# EAGLE design pierce-test-board3 (EAGLE 6.4)
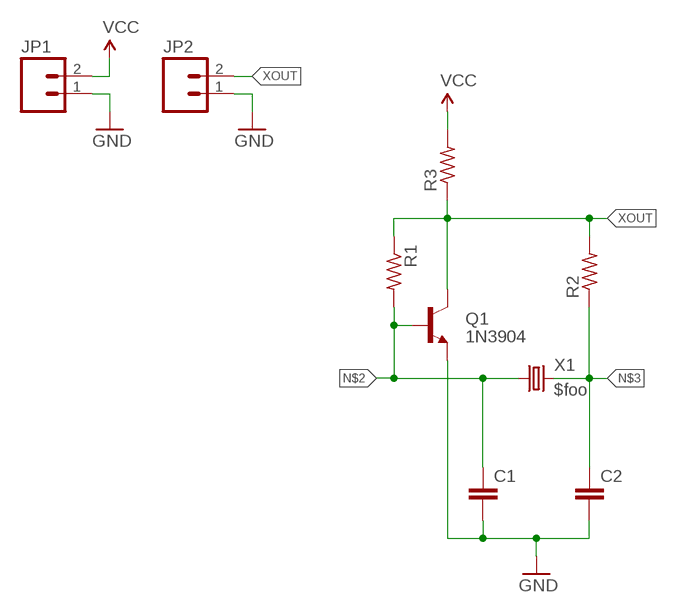
[diagram p0: schematic, sheet 1]

## Parts
C1  CAPACITOR-CERAMIC025-024X044  [C025-024X044]
C2  CAPACITOR-CERAMIC025-024X044  [C025-024X044]
JP1  M02PTH  [1X02]
JP2  M02PTH  [1X02]
Q1  1N3904  TRANSISTOR_NPNTO-92-AMMO-EBC  [TO-92-AMMO]
R1  RESISTORPTH-AXIAL-5.08MM  [RESISTOR-AXIAL-PTH-5.08MM]
R2  RESISTORPTH-AXIAL-5.08MM  [RESISTOR-AXIAL-PTH-5.08MM]
R3  RESISTORPTH-AXIAL-5.08MM  [RESISTOR-AXIAL-PTH-5.08MM]
X1  $foo  CRYSTALHC49UV  [HC49U-V]

## Nets
GND: C1.2 C2.2 JP1.1 JP2.1 Q1.1(E)
N$2: C1.1 Q1.2(B) R1.P$2 X1.1
N$3: C2.1 R2.P$1 X1.2
VCC: JP1.2 R3.P$2
XOUT: JP2.2 Q1.3(C) R1.P$1 R2.P$2 R3.P$1

## Library data of the parts
C1 C2 = A_butts:CAPACITOR-CERAMIC: CAPACITOR, European symbol
JP1 JP2 = A_butts:M02: Standard 2-pin 0.1" header. Use with - straight break away headers ( PRT-00116) - right angle break away headers (PRT-00553) - swiss pins (PRT-00743) - machine pins (PRT-00117) - female headers (PRT-00115) Molex polarized connector foot print use with: PRT-08233 with associated crimp pins and housings. 2.54_SCREWTERM for use with PRT-10571. 3.5mm Screw Terminal footprints for PRT-08084 5mm Screw Terminal footprints for use with PRT-08433
Q1 = A_butts:TRANSISTOR_NPN: Generic NPN BJT MMBT2222A - TRANS-08049 (SOT-23, 1A 40V) MPSA42 - TRANS-09116 (SOT-23, 500mA 300V) MMBT5088LT1G - TRANS-11160 (SOT-23, 50 mA 30V) BC547 - COM-08928 <http://www.sparkfun.com/products/8928> (TO-92 45V 100mA) (1.Collector 2.Base 3.Emitter) 2N3904 - COM-00521 <http://www.sparkfun.com/products/521> (TO-92 40V 200mA) (1.Emitter 2.Base 3.Collector) P2N2222A - COM-12852 <http://www.sparkfun.com/products/12852> (TO-92 40V 600mA) (1.Collector 2.Base 3.Emitter)
R1-R3 = A_butts:RESISTOR: RESISTOR, American symbol
X1 = A_butts:CRYSTAL: Various standard crystals. Proven footprints. Spark Fun Electronics SKU : COM-00534

## Board
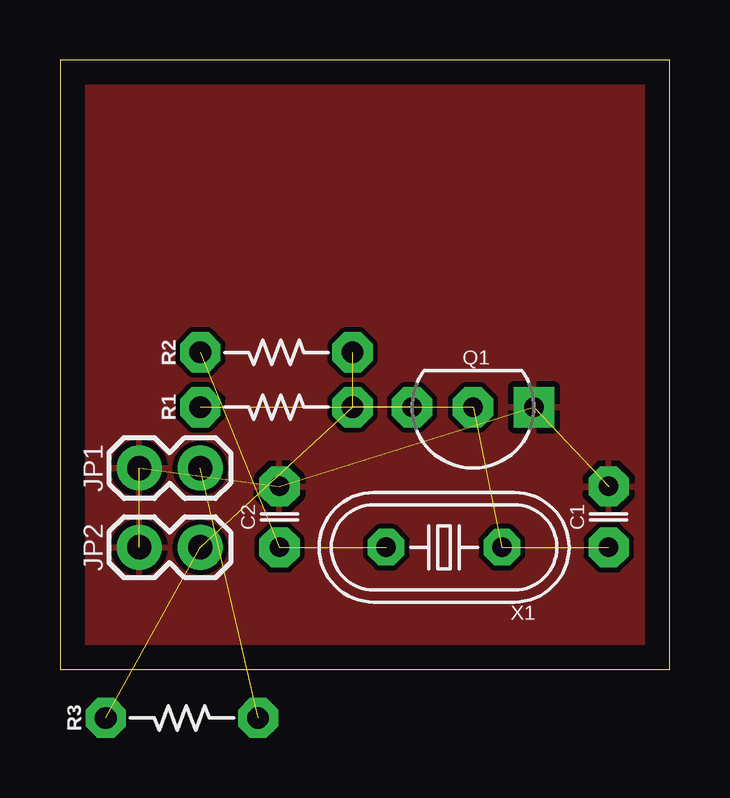
[diagram p1: board, top side]

Size 25.4 x 25.4 mm. Coordinates in mm from the lower left corner, seen from the top.
Outline: 0,0 25.4,0 25.4,25.4 0,25.4 0,0
Copper layers (1*16): Top 0.035mm / dielectric 1.5mm / Bottom 0.035mm
Design rules "default": minimum track width 10mil, minimum drill 0.6mm, track to track 8mil, track to pad 8mil, pad to pad 8mil, via to via 8mil, smd to smd 8mil, copper to edge 40mil, drill to drill 8mil, minimum pad ring 10mil, minimum via ring 8mil, stop-mask expansion 4mil, vias tented up to drill 0mil, thermal gap 10mil

### Footprints (pad centres in the part's own frame; a part is rotated, then mirrored left to right if it is on the bottom)
C025-024X044 = drill 0.813 pad 1.676 octagon: 1 -1.27,0; 2 1.27,0
1X02 = drill 1.016 pad 1.88: 1 0,0; 2 2.54,0
TO-92-AMMO = drill 0.813 pad 1.676 square: 1 -2.54,0 | drill 0.813 pad 1.676 octagon: 2 0,0; 3 2.54,0
RESISTOR-AXIAL-PTH-5.08MM = drill 0.9 pad 1.676 octagon: P$1 -3.175,0; P$2 3.175,0
HC49U-V = drill 0.813 pad 1.524 octagon: 1 -2.413,0; 2 2.413,0

### Placement (x,y rotation side)
C1  22.86,6.35 90 top
C2  9.14,6.35 90 top
JP1  3.3,8.38 0 top
JP2  3.3,5.08 0 top
Q1  17.21,10.92 180 top
R1  9.02,10.92 180 top
R2  9.02,13.21 0 top
R3  5.08,-2.03 0 top
X1  16,5.08 180 top

### Tracks (layer width: path | path; a pad name or v marks a point on that pad's centre or on a via)
GND  (4 unrouted)
  pour Top: 0,0 0,25.4 25.4,25.4 25.4,0
N$2  (3 unrouted)
N$3  (2 unrouted)
VCC  (1 unrouted)
XOUT  (4 unrouted)